# Altium schematic sheet Encoder Fin ARM - Encoder MCU.SchDoc
size A
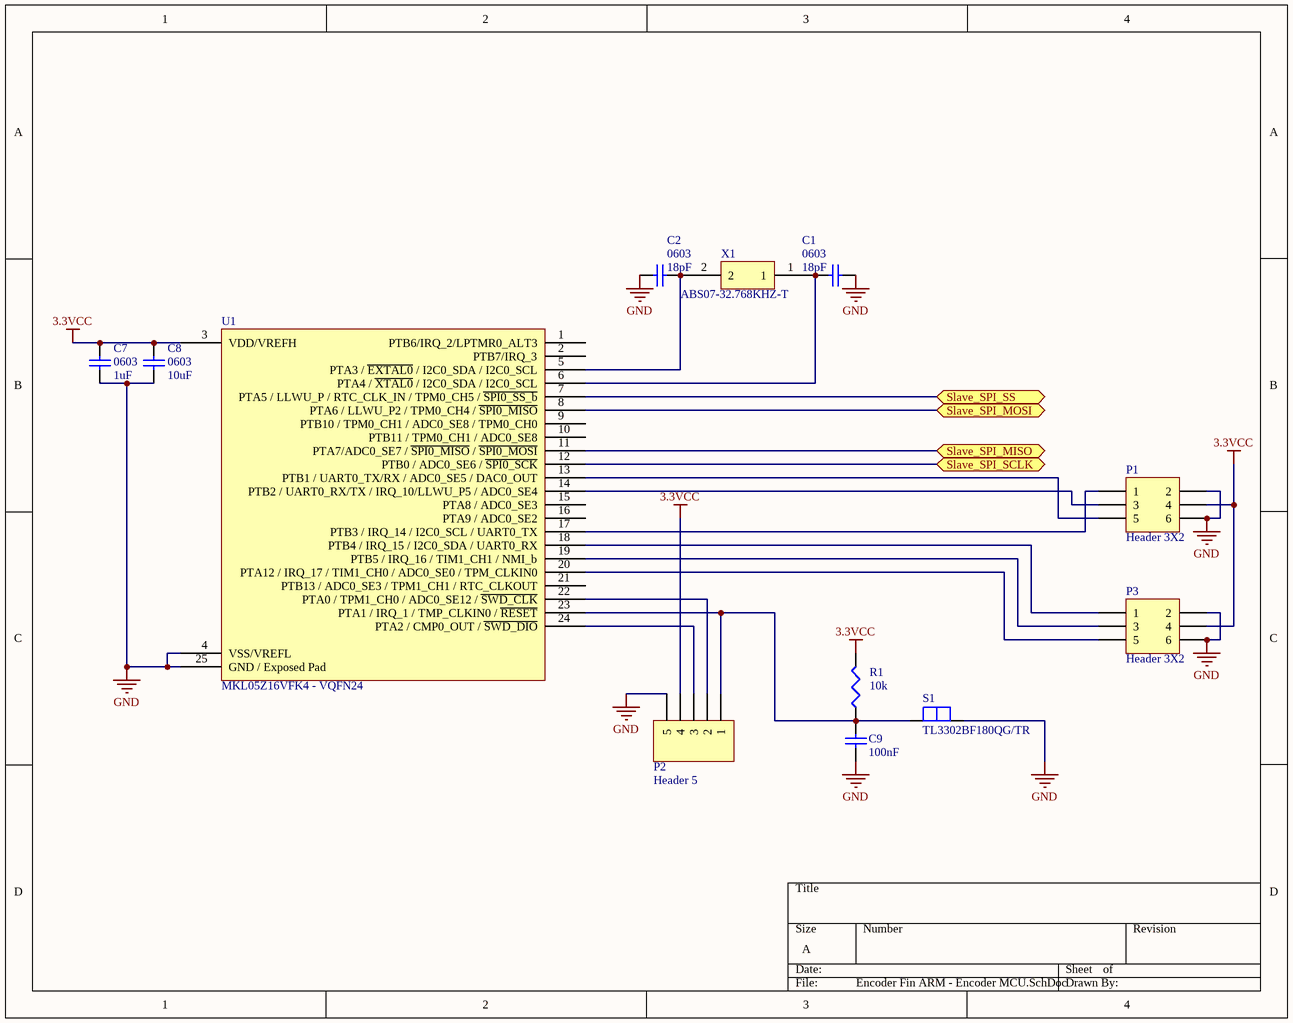
[diagram p0: Encoder Fin ARM - Encoder MCU.SchDoc]

## Parts
C1  0603  value 18pF  [1608[0603]]
C2  0603  value 18pF  [1608[0603]]
C7  0603  value 1uF  [1608[0603]]
C8  0603  value 10uF  [1608[0603]]
C9  value 100nF  [1608[0603]]  (hidden comment: Cap Semi)
P1  Header 3X2  [HDR2X3 Shrouded - Molex 0901301106]
P2  Header 5  [HDR1X5]
P3  Header 3X2  [HDR2X3 Shrouded - Molex 0901301106]
R1  value 10k  [J1-0603]  (hidden comment: Res3)
S1  TL3302BF180QG/TR  [TL3302BF180QG/TR]
U1  MKL05Z16VFK4 - VQFN24  [98ASA00474D]
X1  ABS07-32.768KHZ-T  [ABS07-32.768KHZ-T]

## Ports
Slave_SPI_MISO, Slave_SPI_MOSI, Slave_SPI_SCLK, Slave_SPI_SS

## Nets
3.3VCC: C7.2 C8.2 P1.4 P2.4 P3.4 R1.2 U1.3(VDD/VREFH)
GND: C1.2 C2.2 C7.1 C8.1 C9.1 P1.2 P1.6 P2.5 P3.2 P3.6 S1.2 U1.4(VSS/VREFL) U1.25(GND_/_Exposed_Pad)
Slave_SPI_MISO: U1.11(PTA7/ADC0_SE7_/_~{SPI0_MISO}_/_~{SPI0_MOSI}) ; port Slave_SPI_MISO
Slave_SPI_MOSI: U1.8(PTA6_/_LLWU_P2_/_TPM0_CH4_/_~{SPI0_MISO}) ; port Slave_SPI_MOSI
Slave_SPI_SCLK: U1.12(PTB0_/_ADC0_SE6_/_~{SPI0_SCK}) ; port Slave_SPI_SCLK
Slave_SPI_SS: U1.7(PTA5_/_LLWU_P_/_RTC_CLK_IN_/_TPM0_CH5_/_~{SPI0_SS_b}) ; port Slave_SPI_SS
NetC1_1: C1.1 U1.6(PTA4_/_~{XTAL0}_/_I2C0_SDA_/_I2C0_SCL) X1.1
NetC2_1: C2.1 U1.5(PTA3_/_~{EXTAL0}_/_I2C0_SDA_/_I2C0_SCL) X1.2
NetC9_2: C9.2 P2.1 R1.1 S1.1 U1.23(PTA1_/_IRQ_1_/_TMP_CLKIN0_/_~{RESET})
NetP1_1: P1.1 U1.17(PTB3_/_IRQ_14_/_I2C0_SCL_/_UART0_TX)
NetP1_3: P1.3 U1.14(PTB2_/_UART0_RX/TX_/_IRQ_10/LLWU_P5_/_ADC0_SE4)
NetP1_5: P1.5 U1.13(PTB1_/_UART0_TX/RX_/_ADC0_SE5_/_DAC0_OUT)
NetP2_2: P2.2 U1.22(PTA0_/_TPM1_CH0_/_ADC0_SE12_/_~{SWD_CLK})
NetP2_3: P2.3 U1.24(PTA2_/_CMP0_OUT_/_~{SWD_DIO})
NetP3_1: P3.1 U1.18(PTB4_/_IRQ_15_/_I2C0_SDA_/_UART0_RX)
NetP3_3: P3.3 U1.19(PTB5_/_IRQ_16_/_TIM1_CH1_/_NMI_b)
NetP3_5: P3.5 U1.20(PTA12_/_IRQ_17_/_TIM1_CH0_/_ADC0_SE0_/_TPM_CLKIN0)

Not connected (* = marked no-connect by the designer): U1 1(PTB6/IRQ_2/LPTMR0_ALT3) 2(PTB7/IRQ_3) 9(PTB10_/_TPM0_CH1_/_ADC0_SE8_/_TPM0_CH0) 10(PTB11_/_TPM0_CH1_/_ADC0_SE8) 15(PTA8_/_ADC0_SE3) 16(PTA9_/_ADC0_SE2) 21(PTB13_/_ADC0_SE3_/_TPM1_CH1_/_RTC_CLKOUT)

## Library data of the parts
C1 C2 C7-C9 = Cap Semi: Capacitor (Semiconductor SIM Model); Published: 8-Jun-2000; LatestRevisionDate: 29-May-2009; LatestRevisionNote: IPC-7351 Footprint Added.; PackageReference: C1206; Publisher: Altium Limited; PackageDescription: Chip Capacitor
P1 P3 = Header 3X2: Header, 3-Pin, Dual row; LatestRevisionDate: 17-Jul-2002; LatestRevisionNote: Re-released for DXP Platform.; Publisher: Altium Limited
P2 = Header 5: Header, 5-Pin; LatestRevisionDate: 17-Jul-2002; LatestRevisionNote: Re-released for DXP Platform.; Publisher: Altium Limited
R1 = Res3: Resistor; Published: 8-Jun-2000; LatestRevisionDate: 29-May-2009; LatestRevisionNote: IPC-7351 Footprint Added.; PackageReference: J1-0603; Publisher: Altium Limited; PackageDescription: Chip Resistor
S1 = TL3302BF180QG/TR: Tactile Switch Tiny
U1 = MKL05Z16VFK4 - 24 Pin VQFN: ARM Cortex M0+
X1 = ABS07-32.768KHZ-T: ABS07-32.768KHZ-T RTC Crystal Oscillator